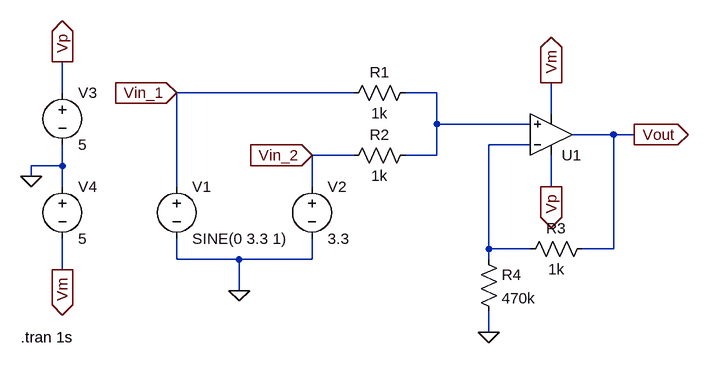
[diagram p0: schematic Summing-Amplifier.asc]
Summing-Amplifier.asc, the LTspice schematic file:
Version 4
SHEET 1 880 680
WIRE -448 128 -448 80
WIRE 0 128 -272 128
WIRE 128 128 80 128
WIRE 304 160 304 112
WIRE 128 176 128 128
WIRE 272 176 128 176
WIRE 400 192 336 192
WIRE 432 192 400 192
WIRE 272 208 208 208
WIRE 0 224 -64 224
WIRE 128 224 128 176
WIRE 128 224 80 224
WIRE -448 240 -448 208
WIRE -448 240 -496 240
WIRE -496 256 -496 240
WIRE -448 272 -448 240
WIRE -272 272 -272 128
WIRE -64 272 -64 224
WIRE 304 272 304 224
WIRE 208 368 208 208
WIRE 272 368 208 368
WIRE 400 368 400 192
WIRE 400 368 352 368
WIRE -272 384 -272 352
WIRE -176 384 -272 384
WIRE -64 384 -64 352
WIRE -64 384 -176 384
WIRE 208 384 208 368
WIRE -448 400 -448 352
WIRE -176 432 -176 384
WIRE 208 496 208 464
FLAG -496 256 0
FLAG -176 432 0
FLAG -448 80 Vp
IOPIN -448 80 Out
FLAG -448 400 Vm
IOPIN -448 400 Out
FLAG 304 272 Vp
IOPIN 304 272 Out
FLAG 304 112 Vm
IOPIN 304 112 Out
FLAG 432 192 Vout
IOPIN 432 192 Out
FLAG -272 128 Vin_1
IOPIN -272 128 In
FLAG -64 224 Vin_2
IOPIN -64 224 In
FLAG 208 496 0
DATAFLAG 400 192 ""
SYMBOL voltage -272 256 R0
WINDOW 123 0 0 Left 0
WINDOW 39 0 0 Left 0
SYMATTR InstName V1
SYMATTR Value SINE(0 3.3 1)
SYMBOL voltage -64 256 R0
WINDOW 123 0 0 Left 0
WINDOW 39 0 0 Left 0
SYMATTR InstName V2
SYMATTR Value 3.3
SYMBOL res 96 112 R90
WINDOW 0 0 56 VBottom 2
WINDOW 3 32 56 VTop 2
SYMATTR InstName R1
SYMATTR Value 1k
SYMBOL res 96 208 R90
WINDOW 0 0 56 VBottom 2
WINDOW 3 32 56 VTop 2
SYMATTR InstName R2
SYMATTR Value 1k
SYMBOL voltage -448 112 R0
WINDOW 123 0 0 Left 0
WINDOW 39 0 0 Left 0
SYMATTR InstName V3
SYMATTR Value 5
SYMBOL voltage -448 256 R0
WINDOW 123 0 0 Left 0
WINDOW 39 0 0 Left 0
SYMATTR InstName V4
SYMATTR Value 5
SYMBOL OpAmps\\UniversalOpAmp1 304 192 M180
SYMATTR InstName U1
SYMBOL res 192 368 R0
SYMATTR InstName R4
SYMATTR Value 470k
SYMBOL res 368 352 R90
WINDOW 0 0 56 VBottom 2
WINDOW 3 32 56 VTop 2
SYMATTR InstName R3
SYMATTR Value 1k
TEXT -512 504 Left 2 !.tran 1s

The netlist it stands for:
* Summing-Amplifier.asc
V1 Vin_1 0 SINE(0 3.3 1)
V2 Vin_2 0 3.3
R1 N001 Vin_1 1k
R2 N001 Vin_2 1k
V3 Vp 0 5
V4 0 Vm 5
XU1 N001 N002 Vp Vm Vout level1 Avol=1Meg GBW=10Meg Vos=0 En=0 Enk=0 In=0 Ink=0 Rin=500Meg  ; pins In+ In- V+ V- OUT
R4 N002 0 470k
R3 Vout N002 1k
.tran 1s
.lib UniversalOpAmp1.lib
.backanno
.end